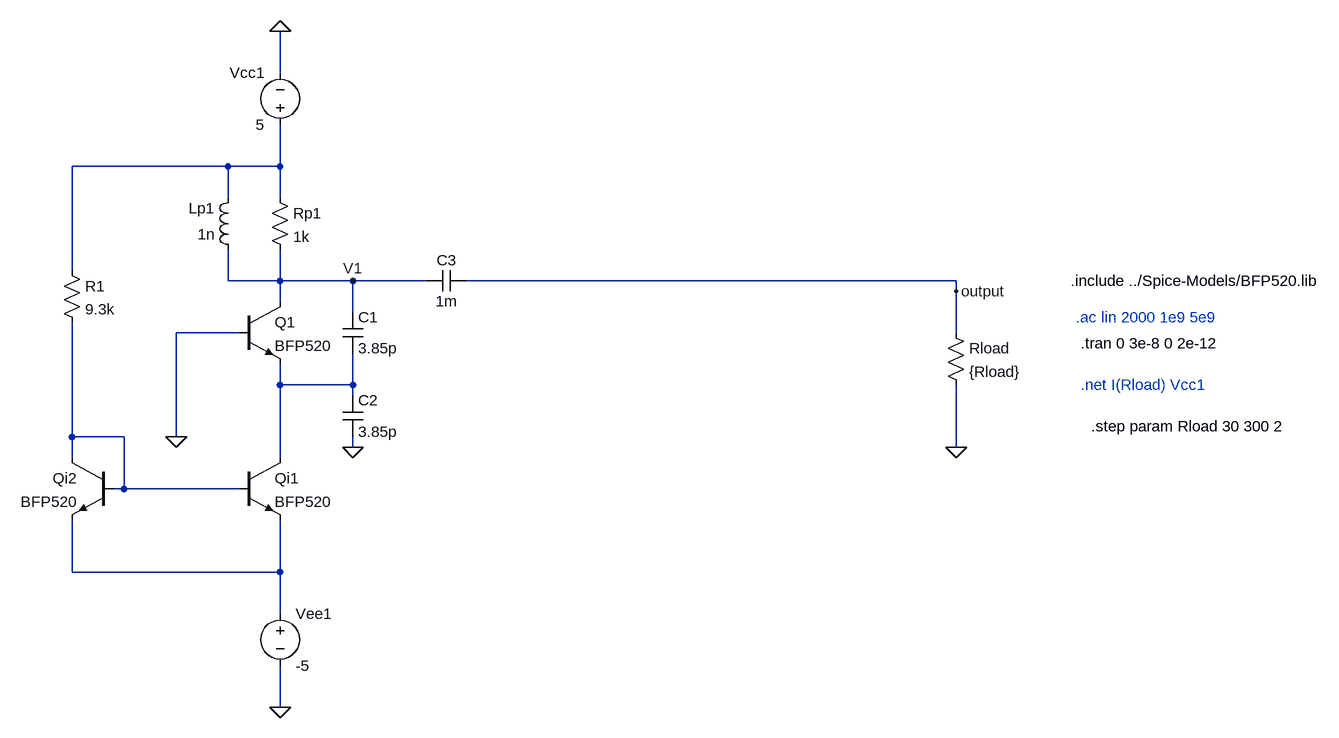
[diagram p0: schematic trans-with-load.asc]
trans-with-load.asc, the LTspice schematic file:
Version 4
SHEET 1 1724 864
WIRE 128 -128 128 -192
WIRE 48 16 -192 16
WIRE 128 16 128 -48
WIRE 128 16 48 16
WIRE 48 64 48 16
WIRE 128 64 128 16
WIRE -192 176 -192 16
WIRE 48 192 48 144
WIRE 128 192 128 144
WIRE 128 192 48 192
WIRE 240 192 128 192
WIRE 352 192 240 192
WIRE 1168 192 416 192
WIRE 1168 208 1168 192
WIRE 128 224 128 192
WIRE 240 240 240 192
WIRE 64 272 -32 272
WIRE 1168 272 1168 208
WIRE 128 352 128 320
WIRE 240 352 240 304
WIRE 240 352 128 352
WIRE 240 368 240 352
WIRE -192 432 -192 256
WIRE -112 432 -192 432
WIRE -32 432 -32 272
WIRE 240 448 240 432
WIRE 1168 448 1168 352
WIRE -192 464 -192 432
WIRE 128 464 128 352
WIRE -112 512 -112 432
WIRE -112 512 -128 512
WIRE 64 512 -112 512
WIRE -192 640 -192 560
WIRE 128 640 128 560
WIRE 128 640 -192 640
WIRE 128 704 128 640
WIRE 128 848 128 784
FLAG 128 -192 0
FLAG 128 848 0
FLAG -32 432 0
FLAG 240 448 0
FLAG 240 192 V1
FLAG 1168 448 0
FLAG 1168 208 output
SYMBOL npn 64 224 R0
SYMATTR InstName Q1
SYMATTR Value BFP520
SYMBOL ind 64 160 R180
WINDOW 0 36 80 Left 2
WINDOW 3 36 40 Left 2
SYMATTR InstName Lp1
SYMATTR Value 1n
SYMBOL Res 112 48 R0
SYMATTR InstName Rp1
SYMATTR Value 1k
SYMBOL Voltage 128 -32 R180
WINDOW 0 24 96 Left 2
WINDOW 3 24 16 Left 2
SYMATTR InstName Vcc1
SYMATTR Value 5
SYMBOL npn 64 464 R0
SYMATTR InstName Qi1
SYMATTR Value BFP520
SYMBOL npn -128 464 M0
SYMATTR InstName Qi2
SYMATTR Value BFP520
SYMBOL Res -208 160 R0
SYMATTR InstName R1
SYMATTR Value 9.3k
SYMBOL Voltage 128 688 R0
SYMATTR InstName Vee1
SYMATTR Value -5
SYMBOL cap 224 240 R0
SYMATTR InstName C1
SYMATTR Value 3.85p
SYMBOL cap 224 368 R0
SYMATTR InstName C2
SYMATTR Value 3.85p
SYMBOL cap 416 176 R90
WINDOW 0 0 32 VBottom 2
WINDOW 3 32 32 VTop 2
SYMATTR InstName C3
SYMATTR Value 1m
SYMBOL Res 1152 256 R0
SYMATTR InstName Rload
SYMATTR Value {Rload}
TEXT 1344 192 Left 2 !.include ../Spice-Models/BFP520.lib
TEXT 1352 248 Left 2 ;.ac lin 2000 1e9 5e9
TEXT 1360 288 Left 2 !.tran 0 3e-8 0 2e-12
TEXT 1360 352 Left 2 ;.net I(Rload) Vcc1
TEXT 1376 416 Left 2 !.step param Rload 30 300 2

The netlist it stands for:
* trans-with-load.asc
Q1 V1 0 N002 0 BFP520
Lp1 V1 N001 1n
Rp1 N001 V1 1k
Vcc1 N001 0 5
Qi1 N002 N003 N004 0 BFP520
Qi2 N003 N003 N004 0 BFP520
R1 N001 N003 9.3k
Vee1 N004 0 -5
C1 V1 N002 3.85p
C2 N002 0 3.85p
C3 output V1 1m
Rload output 0 {Rload}
.model NPN NPN
.model PNP PNP
.lib standard.bjt
.include ../Spice-Models/BFP520.lib
* .ac lin 2000 1e9 5e9
.tran 0 3e-8 0 2e-12
* .net I(Rload) Vcc1
.step param Rload 30 300 2
.backanno
.end